# Altium project mb1225.PrjPCB (part 4 of 4)

## Sheet DSI_LCD.SchDoc: MIPI connector for DSI LCD and HDMI boards.
size A4; Date: 29-OCT-2015; Author: A.B; CompanyName: STMicroelectronics; Organization: MCD/TOOLS/GNB; Address1: 12, Rue Jules HOROWITZ; Address2: 38019 Grenoble; Address3: FRANCE; DocumentNumber: MB1225; Revision: B-01; SheetNumber: 12; SheetTotal: 13; Project: STM32F769I-DISCO
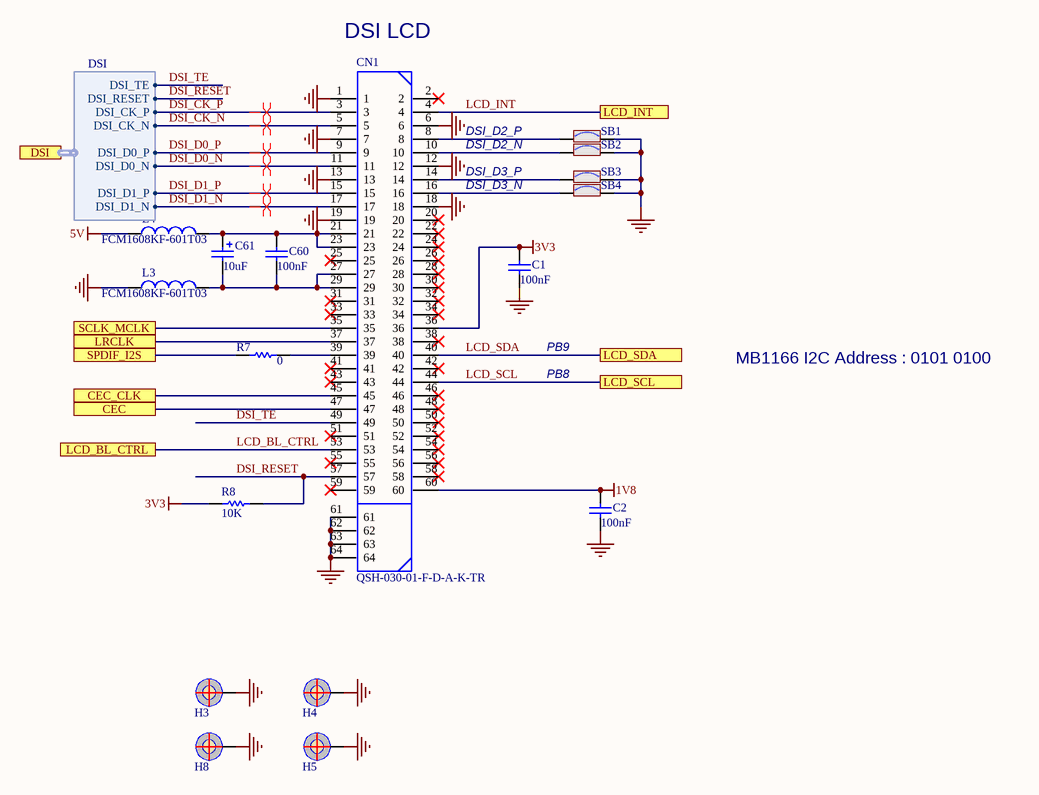
[diagram p12: DSI_LCD.SchDoc]

### Parts
C1  100nF  [0603C]
C2  100nF  [0603C]
C60  100nF  [0603C]
C61  10uF  [TAN-A]
CN1  QSH-030-01-F-D-A-K-TR  [QSH-030-01-F-D-A]
H3  POSITION HOLE  [HOLE_C9D4R5-1]  (value not drawn)
H4  POSITION HOLE  [HOLE_C9D4R5]  (value not drawn)
H5  POSITION HOLE  [HOLE_C9D4R5]  (value not drawn)
H8  POSITION HOLE  [HOLE_C9D4R5-1]  (value not drawn)
L3  FCM1608KF-601T03  [0603L]
L4  FCM1608KF-601T03  [0603L]
R7  0  [0402R]
R8  10K  [0402R]
SB1  Solder Bridge ON  [JP2_SMD]  (value not drawn)
SB2  Solder Bridge ON  [JP2_SMD]  (value not drawn)
SB3  Solder Bridge ON  [JP2_SMD]  (value not drawn)
SB4  Solder Bridge ON  [JP2_SMD]  (value not drawn)

### Ports
CEC, CEC_CLK, DSI (harness DSI), LCD_BL_CTRL, LCD_INT, LCD_SCL, LCD_SDA, LRCLK, SCLK_MCLK, SPDIF_I2S

### Harnesses
DSI: DSI_CK_P, DSI_CK_N, DSI_D0_P, DSI_D0_N, DSI_D1_P, DSI_D1_N, DSI_TE, DSI_RESET

### Nets
1V8: C2.2 CN1.60
3V3: C1.2 CN1.36 R8.1
5V: L4.1
GND: C1.1 C2.1 CN1.1 CN1.6 CN1.7 CN1.12 CN1.13 CN1.18 CN1.19 CN1.61 CN1.62 CN1.63 CN1.64 H3.1 H4.1 H5.1 H8.1 L3.1 SB1.2 SB2.2 SB3.2 SB4.2  [project net POE7]
CEC: CN1.47 ; port CEC
CEC_CLK: CN1.45 ; port CEC_CLK
DSI_CK_N: CN1.5 ; port DSI.DSI_CK_N
DSI_CK_P: CN1.3 ; port DSI.DSI_CK_P
DSI_D0_N: CN1.11 ; port DSI.DSI_D0_N
DSI_D0_P: CN1.9 ; port DSI.DSI_D0_P
DSI_D1_N: CN1.17 ; port DSI.DSI_D1_N
DSI_D1_P: CN1.15 ; port DSI.DSI_D1_P
DSI_RESET: CN1.57 R8.2 ; port DSI.DSI_RESET
DSI_TE: CN1.49 ; port DSI.DSI_TE
LCD_BL_CTRL: CN1.53 ; port LCD_BL_CTRL
LCD_INT: CN1.4 ; port LCD_INT
LCD_SCL: CN1.44 ; port LCD_SCL  [project net AUDIO_SCL]
LCD_SDA: CN1.40 ; port LCD_SDA  [project net AUDIO_SDA]
LRCLK: CN1.37 ; port LRCLK
PD11: R7.1 ; port SPDIF_I2S
SCLK_MCLK: CN1.35 ; port SCLK_MCLK
NetC60_1: C60.1 C61.2 CN1.27 CN1.29 L3.2
NetC60_2: C60.2 C61.1 CN1.21 CN1.23 L4.2
NetCN1_8: CN1.8 SB1.1
NetCN1_10: CN1.10 SB2.1
NetCN1_14: CN1.14 SB3.1
NetCN1_16: CN1.16 SB4.1
NetCN1_39: CN1.39 R7.2

Not connected (* = marked no-connect by the designer): CN1 2* 20* 22* 24* 25* 26* 28* 30* 31* 32* 33* 34* 38* 41* 42* 43* 46* 48* 50* 51* 52* 54* 55* 56* 58* 59*

### Layout directives
differential pair: DSI_CK_N, DSI_CK_P, DSI_D0_N, DSI_D0_P, DSI_D1_N, DSI_D1_P

### Notes on the sheet
- DSI LCD
- DSI_D2_P
- DSI_D2_N
- DSI_D3_P
- DSI_D3_N
- PB9
- PB8
- MB1166 I2C Address : 0101 0100
- Title:
- Project:
- Size:
- Revision:
- Variant:
- A4
- -
- Date:
- Reference:
- Sheet:
- of

### Library data of the parts
C1 C2 C60 = Cap_100nF_X7R_10%_0603: as C16 on sheet PoE; Revision: July-2002: Re-released for DXP Platform.; Value: 100nF; Order: CC0603KRX7R9BB104; Manuf_1: YAGEO; ECCN_US/EU: n/a
C61 = Cap_10uF_POL_10%_TANA: as C36 on sheet Ethernet; Revision: July-2002: Re-released for DXP Platform.; Value: 10uF; Manuf_1: VISHAY; Order: *; ECCN_US/EU: n/a
CN1 = QSH-030-01-F-D-A: HIGH SPEED SOCKET STRIP, .5mm PITCH, 60 PINS; Manuf_1: SAMTEC; Provided: Sub Co; Ref St: 9183715; Manuf_Part_1: QSH-030-01-F-D-A-K-TR; ECCN_US/EU: n/a
L3 L4 = BEAD_600R_350MA_0603: as L6 on sheet STM32F7; Revision: July-2002: Re-released for DXP Platform.; Manuf_Part_1: FCM1608KF-601T03; Manuf_1: Tai-tech; ECCN_US/EU: n/a
R7 = Res_0_5%_0402: as R129 on sheet USB_OTG_HS; Value: 0; ECCN_US/EU: n/a; Manuf_1: YAGEO; Distrib: FARNELL
R8 = Res_10K_1%_0402: as R134 on sheet USB_OTG_HS; Value: 10K; Manuf_1: YAGEO; Order: RC0402FR-0710KL; ECCN_US/EU: n/a
SB1-SB4 = SB_ON: Solder: YES; Revision: July-2002: Re-released for DXP Platform.; ECCN_US/EU: n/a

## Nets that join several sheets
1V8: ST_LINK_V2-1 (C100.2 U14.2 U14.4), AUDIO (6 pins), USB_OTG_HS (C145.2 U20.28 U20.30), DSI_LCD (C2.2 CN1.60)
3V3: ST_LINK_V2-1 (C48.2 C49.2 U7.4 U14.3), AUDIO (24 pins), Peripherals (16 pins), QSPI (C96.2 R86.2 U12.8 U250.8), Arduino_ Connectors (CN11.2 CN11.4), SDRAM (28 pins), USB_OTG_HS (11 pins), STM32F7 (12 pins), Ethernet (13 pins), DSI_LCD (C1.2 CN1.36 R8.1)
5V: ST_LINK_V2-1 (11 pins), Arduino_ Connectors (CN11.5), USB_OTG_HS (C150.1 U20.21 U21.5), DSI_LCD (L4.1)
5V_POE: ST_LINK_V2-1 (CN3.7 D6.1), PoE (7 pins)
5V_USB_HS: ST_LINK_V2-1 (CN3.3 D8.1), USB_OTG_HS (CN15.1 D12.A1 L7.2)
E5V: ST_LINK_V2-1 (6 pins), Arduino_ Connectors (R103.2)
POE7: Top (H1.1 H2.1 H6.1 H7.1), ST_LINK_V2-1 (52 pins), AUDIO (55 pins), Peripherals (11 pins), QSPI (C96.1 U12.4 U250.4), Arduino_ Connectors (5 pins), SDRAM (28 pins), USB_OTG_HS (25 pins), STM32F7 (58 pins), Ethernet (14 pins), PoE (15 pins), DSI_LCD (22 pins)
VIN: ST_LINK_V2-1 (C129.2 U18.3), Arduino_ Connectors (CN11.8)
VREF+: Arduino_ Connectors (C85.2 R98.2), STM32F7 (C101.1 C102.2 R110.2 U13.P1)
ARD_A0: Arduino_ Connectors (CN14.1), STM32F7 (U13.P3)
ARD_A1: Arduino_ Connectors (CN14.2), STM32F7 (U13.N4)
ARD_A2: Arduino_ Connectors (CN14.3), STM32F7 (U13.M4)
ARD_A3: Arduino_ Connectors (CN14.4), STM32F7 (U13.L1)
ARD_A4: Arduino_ Connectors (SB14.1), STM32F7 (U13.L3)
ARD_A5: Arduino_ Connectors (SB12.1), STM32F7 (U13.L2)
ARD_D0: Arduino_ Connectors (CN13.1), STM32F7 (U13.G15)
ARD_D1: Arduino_ Connectors (CN13.2), STM32F7 (U13.H15)
ARD_D2: Arduino_ Connectors (CN13.3), STM32F7 (U13.R7)
ARD_D3: Arduino_ Connectors (CN13.4), STM32F7 (U13.K2)
ARD_D4: Arduino_ Connectors (CN13.5), STM32F7 (U13.R6)
ARD_D5: Arduino_ Connectors (CN13.6), STM32F7 (U13.G14)
ARD_D6: Arduino_ Connectors (CN13.7), STM32F7 (U13.K1)
ARD_D7: Arduino_ Connectors (CN13.8), STM32F7 (U13.N8)
ARD_D8: Arduino_ Connectors (CN9.1), STM32F7 (U13.M9)
ARD_D9: Arduino_ Connectors (CN9.2), STM32F7 (U13.P13)
ARD_D10: Arduino_ Connectors (CN9.3), STM32F7 (U13.C15)
ARD_D11: Arduino_ Connectors (CN9.4), STM32F7 (U13.R15)
ARD_D12: Arduino_ Connectors (CN9.5), STM32F7 (U13.R14)
ARD_D13: Arduino_ Connectors (CN9.6 SB15.2), STM32F7 (U13.B15)
ARD_D14: Arduino_ Connectors (CN9.9 SB13.1), STM32F7 (R89.2 U13.B4)
ARD_D15: Arduino_ Connectors (CN9.10 SB11.1), STM32F7 (R91.2 U13.A7)
Audio_INT: AUDIO (U11.G3), STM32F7 (U13.B10)
AUDIO_SCL: AUDIO (R88.1), STM32F7 (R17.1 U13.M10), DSI_LCD (CN1.44)
AUDIO_SDA: AUDIO (R95.1), STM32F7 (R90.2 U13.B5), DSI_LCD (CN1.40)
B_USER: Peripherals (SB9.1), STM32F7 (U13.N3)
CEC: STM32F7 (U13.A13), DSI_LCD (CN1.47)
CEC_CLK: STM32F7 (TP2.1 U13.F15), DSI_LCD (CN1.45)
DFSDM_CKOUT: AUDIO (5 pins), STM32F7 (TP102.1 U13.C11)
DFSDM_DATIN1: AUDIO (TP103.1 U5.4 U6.4), STM32F7 (TP101.1 U13.L4)
DFSDM_DATIN5: AUDIO (TP104.1 U8.4 U9.4), STM32F7 (TP100.1 U13.B13)
DSI_CK_N: STM32F7 (U13.H13), DSI_LCD (CN1.5)
DSI_CK_P: STM32F7 (U13.H12), DSI_LCD (CN1.3)
DSI_D0_N: STM32F7 (U13.J13), DSI_LCD (CN1.11)
DSI_D0_P: STM32F7 (U13.J12), DSI_LCD (CN1.9)
DSI_D1_N: STM32F7 (U13.F13), DSI_LCD (CN1.17)
DSI_D1_P: STM32F7 (U13.F12), DSI_LCD (CN1.15)
DSI_RESET: STM32F7 (U13.D10), DSI_LCD (CN1.57 R8.2)
DSI_TE: STM32F7 (U13.P7), DSI_LCD (CN1.49)
EXT_RST: Peripherals (CN2.6 R54.2), STM32F7 (U13.N13)
EXT_SCL: Peripherals (CN2.5 R56.2), STM32F7 (U13.M12)
EXT_SDA: Peripherals (R52.1 SB6.1), STM32F7 (U13.J15)
FMC_A0: SDRAM (U17.G8), STM32F7 (U13.D2)
FMC_A1: SDRAM (U17.G9), STM32F7 (U13.E2)
FMC_A2: SDRAM (U17.F7), STM32F7 (U13.G2)
FMC_A3: SDRAM (U17.F3), STM32F7 (U13.H2)
FMC_A4: SDRAM (U17.G1), STM32F7 (U13.J2)
FMC_A5: SDRAM (U17.G2), STM32F7 (U13.K3)
FMC_A6: SDRAM (U17.G3), STM32F7 (U13.M6)
FMC_A7: SDRAM (U17.H1), STM32F7 (U13.N6)
FMC_A8: SDRAM (U17.H2), STM32F7 (U13.P6)
FMC_A9: SDRAM (U17.J3), STM32F7 (U13.M8)
FMC_A10: SDRAM (U17.G7), STM32F7 (U13.N7)
FMC_A11: SDRAM (U17.H9), STM32F7 (U13.M7)
FMC_A12: SDRAM (U17.E3), STM32F7 (U13.M13)
FMC_BA0: SDRAM (U17.J7), STM32F7 (U13.N12)
FMC_BA1: SDRAM (U17.H8), STM32F7 (U13.N11)
FMC_D0: SDRAM (TP27.1 U17.R8), STM32F7 (U13.L12)
FMC_D1: SDRAM (U17.N7), STM32F7 (U13.K13)
FMC_D2: SDRAM (U17.R9), STM32F7 (U13.B12)
FMC_D3: SDRAM (U17.N8), STM32F7 (U13.C12)
FMC_D4: SDRAM (U17.P9), STM32F7 (U13.R8)
FMC_D5: SDRAM (U17.M8), STM32F7 (U13.N9)
FMC_D6: SDRAM (U17.M7), STM32F7 (U13.P9)
FMC_D7: SDRAM (U17.L8), STM32F7 (U13.R9)
FMC_D8: SDRAM (U17.L2), STM32F7 (U13.P10)
FMC_D9: SDRAM (U17.M3), STM32F7 (U13.R10)
FMC_D10: SDRAM (U17.M2), STM32F7 (U13.R12)
FMC_D11: SDRAM (U17.P1), STM32F7 (U13.P11)
FMC_D12: SDRAM (U17.N2), STM32F7 (U13.R11)
FMC_D13: SDRAM (U17.R1), STM32F7 (U13.L15)
FMC_D14: SDRAM (U17.N3), STM32F7 (U13.L14)
FMC_D15: SDRAM (U17.R2), STM32F7 (U13.K15)
FMC_D16: SDRAM (U17.E8), STM32F7 (U13.P14)
FMC_D17: SDRAM (U17.D7), STM32F7 (U13.N14)
FMC_D18: SDRAM (U17.D8), STM32F7 (U13.P15)
FMC_D19: SDRAM (U17.B9), STM32F7 (U13.N15)
FMC_D20: SDRAM (U17.C8), STM32F7 (U13.M15)
FMC_D21: SDRAM (U17.A9), STM32F7 (U13.E12)
FMC_D22: SDRAM (U17.C7), STM32F7 (U13.E13)
FMC_D23: SDRAM (U17.A8), STM32F7 (U13.D13)
FMC_D24: SDRAM (U17.A2), STM32F7 (U13.E14)
FMC_D25: SDRAM (U17.C3), STM32F7 (U13.D14)
FMC_D26: SDRAM (U17.A1), STM32F7 (U13.C14)
FMC_D27: SDRAM (U17.C2), STM32F7 (U13.C13)
FMC_D28: SDRAM (U17.B1), STM32F7 (U13.D6)
FMC_D29: SDRAM (U17.D2), STM32F7 (U13.D4)
FMC_D30: SDRAM (U17.D3), STM32F7 (U13.E4)
FMC_D31: SDRAM (U17.E2), STM32F7 (U13.D5)
FMC_NBL0: SDRAM (U17.K9), STM32F7 (U13.A6)
FMC_NBL1: SDRAM (U17.K1), STM32F7 (U13.A5)
FMC_NBL2: SDRAM (U17.F8), STM32F7 (U13.C3)
FMC_NBL3: SDRAM (U17.F2), STM32F7 (U13.D3)
FMC_SDCKE0: SDRAM (U17.J2), STM32F7 (U13.K4)
FMC_SDCLK: SDRAM (TP26.1 U17.J1), STM32F7 (U13.H14)
FMC_SDNCAS: SDRAM (U17.K7), STM32F7 (U13.B7)
FMC_SDNE0: SDRAM (U17.J8), STM32F7 (U13.J4)
FMC_SDNRAS: SDRAM (U17.J9), STM32F7 (U13.P8)
FMC_SDNWE: SDRAM (TP28.1 U17.K8), STM32F7 (U13.J3)
LCD_BL_CTRL: STM32F7 (U13.H3), DSI_LCD (CN1.53)
LCD_INT: STM32F7 (U13.G3), DSI_LCD (CN1.4)
LD_USER1: Peripherals (R62.1), STM32F7 (U13.B9)
LD_USER2: Peripherals (R63.1), STM32F7 (U13.M14)
LRCLK: STM32F7 (TP3.1), DSI_LCD (CN1.37)
NRST: ST_LINK_V2-1 (SB20.2), Peripherals (SB10.1), Arduino_ Connectors (CN11.3), USB_OTG_HS (U20.27), STM32F7 (R106.1 U13.J1), Ethernet (U3.15)
OSC_25M: STM32F7 (R104.1 X2.3), Ethernet (R27.1)
OTG_HS_OverCurrent: USB_OTG_HS (R129.2), STM32F7 (U13.D11)
PA1: STM32F7 (U13.N2), Ethernet (R45.1 U3.14)
PA2: STM32F7 (U13.P2), Ethernet (R47.1 U3.12)
PA3: USB_OTG_HS (U20.3), STM32F7 (U13.R2)
PA5: USB_OTG_HS (U20.1), STM32F7 (U13.P4)
PA7: STM32F7 (U13.R3), Ethernet (R44.2)
PA9: ST_LINK_V2-1 (JP5.1 SB18.1), STM32F7 (U13.E15)
PA10: ST_LINK_V2-1 (JP5.2 SB17.1), STM32F7 (U13.D15)
PA13: ST_LINK_V2-1 (SB22.2), STM32F7 (U13.A15)
PA14: ST_LINK_V2-1 (SB19.2), STM32F7 (U13.A14)
PB0: USB_OTG_HS (U20.4), STM32F7 (U13.R5)
PB1: USB_OTG_HS (U20.5), STM32F7 (U13.R4)
PB2: QSPI (U12.6 U250.6), STM32F7 (U13.M5)
PB4: Peripherals (CN5.2 R82.1), STM32F7 (U13.A9)
PB5: USB_OTG_HS (U20.13), STM32F7 (U13.A8)
PB6: QSPI (R86.1 U12.1 U250.1), STM32F7 (U13.B6)
PB10: USB_OTG_HS (U20.6), STM32F7 (U13.P12)
PB11: USB_OTG_HS (U20.7), STM32F7 (U13.R13)
PB12: USB_OTG_HS (U20.9), STM32F7 (U13.L13)
PB13: USB_OTG_HS (U20.10), STM32F7 (U13.K14)
PC0: USB_OTG_HS (U20.29), STM32F7 (U13.M2)
PC1: STM32F7 (U13.M3), Ethernet (U3.13)
PC4: STM32F7 (U13.N5), Ethernet (R36.2)
PC5: STM32F7 (U13.P5), Ethernet (R32.2)
PC9: QSPI (U12.5 U250.5), STM32F7 (U13.F14)
PC10: QSPI (U12.2 U250.2), STM32F7 (U13.B14)
PC12: Peripherals (R50.1), STM32F7 (U13.A12)
PD2: Peripherals (R57.2), STM32F7 (U13.D12)
PD5: STM32F7 (U13.C10), Ethernet (R40.2 U3.10)
PD6: Peripherals (CN5.5), STM32F7 (U13.B11)
PD7: Peripherals (CN5.3 R81.1), STM32F7 (U13.A11)
PD11: AUDIO (R100.1 TP20.1), STM32F7 (U13.N10), DSI_LCD (R7.1)
PD13: QSPI (U12.7 U250.7), STM32F7 (U13.M11)
PE2: QSPI (U12.3 U250.3), STM32F7 (U13.A3)
PE3: AUDIO (U11.F2), STM32F7 (TP11.1 U13.A2)
PE4: AUDIO (U11.E3), STM32F7 (TP6.1 U13.A1)
PE5: AUDIO (U11.G1), STM32F7 (TP8.1 U13.B1)
PE6: AUDIO (U11.E4), STM32F7 (TP7.1 U13.B2)
PG7: AUDIO (U11.D3), STM32F7 (TP22.1 U13.J14)
PG9: Peripherals (CN5.7 R80.1), STM32F7 (U13.D9)
PG10: Peripherals (CN5.8 R79.1), STM32F7 (U13.C8)
PG11: STM32F7 (U13.B8), Ethernet (U3.16)
PG12: AUDIO (R112.2 R114.2 U15.4), STM32F7 (U13.C7)
PG13: STM32F7 (U13.B3), Ethernet (U3.17)
PG14: STM32F7 (U13.A4), Ethernet (U3.18)
PH4: USB_OTG_HS (U20.2), STM32F7 (U13.H4)
PI11: USB_OTG_HS (U20.31), STM32F7 (U13.F3)
PI15: Peripherals (R73.1 R76.1), STM32F7 (U13.G4)
PJ14: Peripherals (CN2.4 R200.2), STM32F7 (U13.C9)
SCLK_MCLK: STM32F7 (TP1.1), DSI_LCD (CN1.35)
SWO: ST_LINK_V2-1 (SB21.2), STM32F7 (R92.1)
uSD_D2: Peripherals (CN5.1 R83.1), STM32F7 (R93.1)